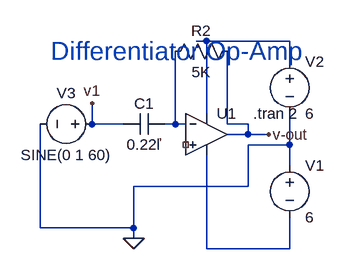
[diagram p0: schematic 6.Differentiator Amplifier.asc]
6.Differentiator Amplifier.asc, the LTspice schematic file:
Version 4.1
SHEET 1 880 680
WIRE 192 32 176 32
WIRE 320 32 192 32
WIRE 320 64 320 32
WIRE 192 144 192 32
WIRE 16 160 16 128
WIRE 64 160 16 160
WIRE 144 160 144 48
WIRE 144 160 128 160
WIRE 160 160 144 160
WIRE 224 160 224 48
WIRE 256 160 224 160
WIRE 256 176 256 160
WIRE 256 176 224 176
WIRE 288 176 256 176
WIRE 320 192 320 144
WIRE 320 192 256 192
WIRE 320 224 320 192
WIRE 256 256 256 192
WIRE 256 256 80 256
WIRE -64 320 -64 160
WIRE 80 320 80 256
WIRE 80 320 -64 320
WIRE 80 336 80 320
WIRE 192 352 192 208
WIRE 320 352 320 304
WIRE 320 352 192 352
FLAG 80 336 0
FLAG 288 176 v-out
FLAG 16 128 v1
SYMBOL OpAmps\\UniversalOpAmp2 192 176 R0
SYMATTR InstName U1
SYMBOL voltage 320 208 R0
WINDOW 123 0 0 Left 0
WINDOW 39 0 0 Left 0
SYMATTR InstName V1
SYMATTR Value 6
SYMBOL voltage 320 48 R0
WINDOW 123 0 0 Left 0
WINDOW 39 0 0 Left 0
SYMATTR InstName V2
SYMATTR Value 6
SYMBOL voltage 32 160 R90
WINDOW 0 -32 56 VBottom 2
WINDOW 3 32 56 VTop 2
WINDOW 123 0 0 Left 0
WINDOW 39 0 0 Left 0
SYMATTR InstName V3
SYMATTR Value SINE(0 1 60)
SYMBOL cap 128 144 R90
WINDOW 0 0 32 VBottom 2
WINDOW 3 32 32 VTop 2
SYMATTR InstName C1
SYMATTR Value 0.22ľ
SYMATTR SpiceLine V=16 Irms=0 Rser=0.0123 Lser=657p mfg="Würth Elektronik" pn="885012208032 WCAP-CSGP 1206" type="X7R"
SYMBOL res 240 32 R90
WINDOW 0 0 56 VBottom 2
WINDOW 3 32 56 VTop 2
SYMATTR InstName R2
SYMATTR Value 5K
SYMATTR SpiceLine tol=1 pwr=0.1
TEXT -48 48 Left 4 ;Differentiator Op-Amp
TEXT 264 144 Left 2 !.tran 2

The netlist it stands for:
* 6.Differentiator Amplifier.asc
X§U1 NC_01 N002 N001 N003 v-out level2 Avol=1Meg GBW=10Meg Slew=10Meg Ilimit=25m Rail=0 Vos=0 En=0 Enk=0 In=0 Ink=0 Rin=500Meg  ; pins In+ In- V+ V- OUT
V1 0 N003 6
V2 N001 0 6
V3 v1 0 SINE(0 1 60)
C1 N002 v1 0.22ľ V=16 Irms=0 Rser=0.0123 Lser=657p mfg="Würth Elektronik" pn="885012208032 WCAP-CSGP 1206" type="X7R"
R2 v-out N002 5K tol=1 pwr=0.1
* Differentiator Op-Amp
.tran 2
.lib UniversalOpAmp2.lib
.backanno
.end